# Altium schematic sheet Sch_Rele.SchDoc: Control de Domótica
size A4; Author: Francisco González González - Eugenia Ipar; CompanyName: Circuito de Relés; DocumentNumber: 7; SheetNumber: 7; SheetTotal: 12; Materia: Técnicas Digitales II; Placa: Conexión a Relés - 12V; Year: 2015; Prof1: Prof: Alarcón, Juan; Prof2: Ayud: Crivelli, Marcelo; Prof3: Ayud: Montalti, Pablo; PageSetup: Record=PageOptions|CenterHorizontal=True|CenterVertical=True|PrintScale=1.00|XCorrection=1.00|YCorrection=1.00|PrintKind=0|BorderSize=5000000|LeftOffset=0|BottomOffset=0|Orientation=2|PaperLength=1000|PaperWidth=1000|Scale=100|PaperSource=7|PrintQuality=-3|MediaType=1|DitherType=10|PrintScaleMode=1|PaperKind=A4|PaperIndex=9
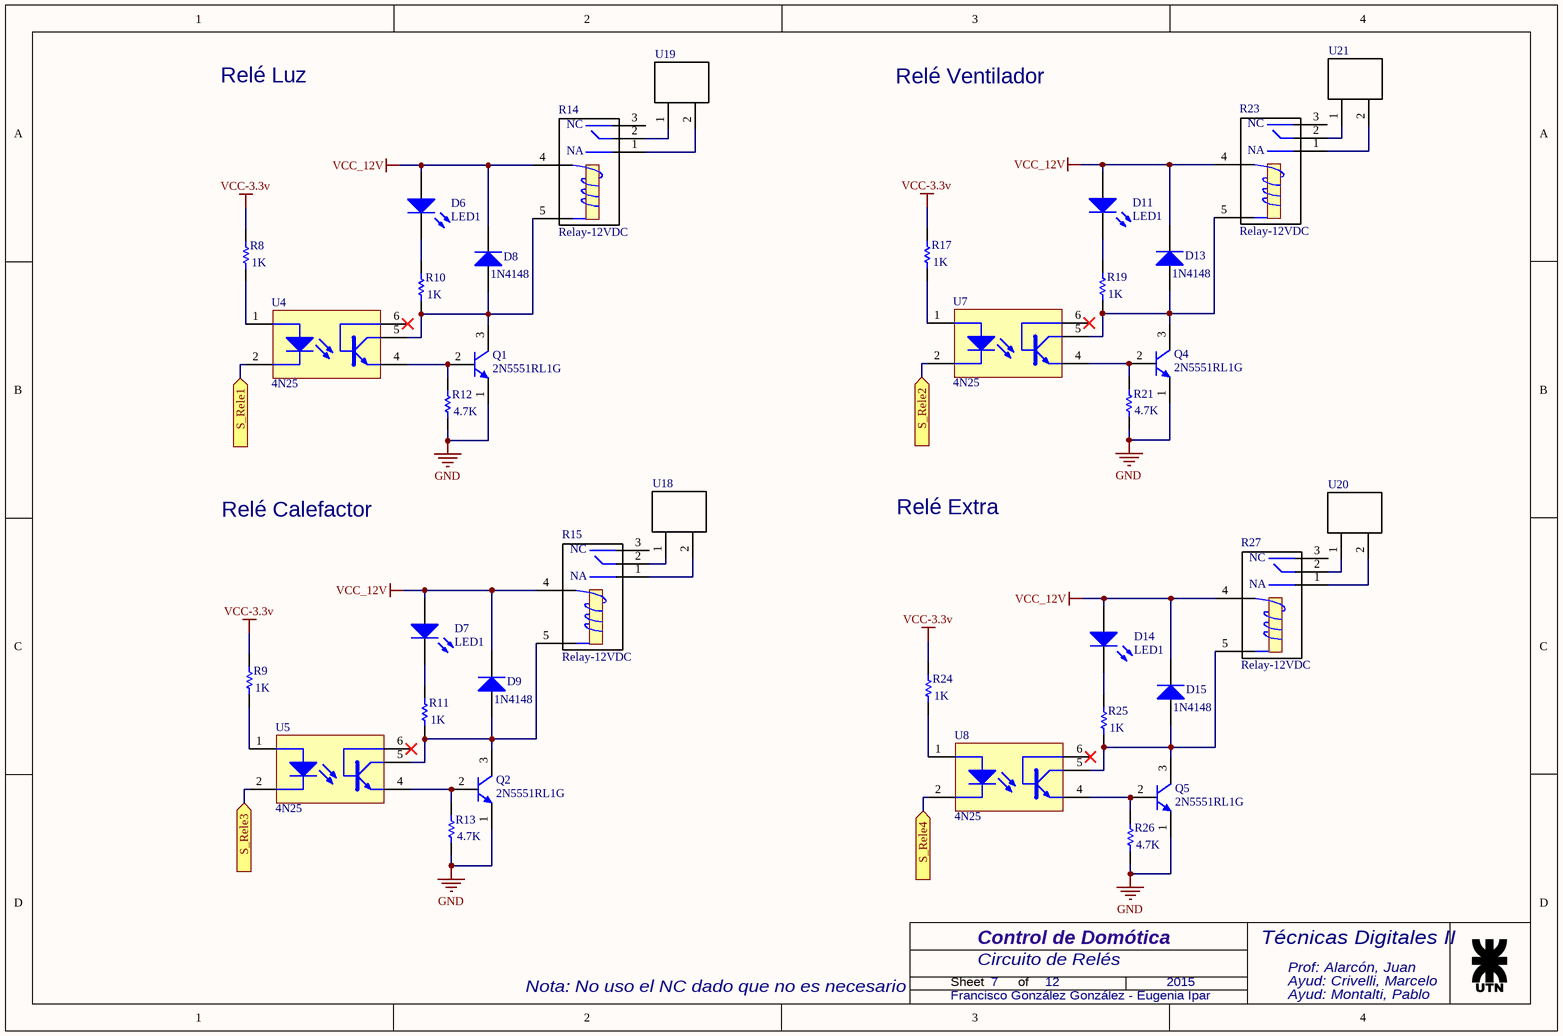
[diagram p0: Sch_Rele.SchDoc]

## Parts
D6  LED1  [Type 3mm]
D7  LED1  [Type 3mm]
D8  1N4148  [DO-35]
D9  1N4148  [DO-35]
D11  LED1  [Type 3mm]
D13  1N4148  [DO-35]
D14  LED1  [Type 3mm]
D15  1N4148  [DO-35]
Q1  2N5551RL1G  [ONSC-TO-92-3-29-11_AM_BL]
Q2  2N5551RL1G  [ONSC-TO-92-3-29-11_AM_BL]
Q4  2N5551RL1G  [ONSC-TO-92-3-29-11_AM_BL]
Q5  2N5551RL1G  [ONSC-TO-92-3-29-11_AM_BL]
R8  value 1K  [AXIAL-0.3]  (hidden comment: Res1)
R9  value 1K  [AXIAL-0.3]  (hidden comment: Res1)
R10  value 1K  [AXIAL-0.3]  (hidden comment: Res1)
R11  value 1K  [AXIAL-0.3]  (hidden comment: Res1)
R12  value 4.7K  [AXIAL-0.3]  (hidden comment: Res1)
R13  value 4.7K  [AXIAL-0.3]  (hidden comment: Res1)
R14  Relay-12VDC  [Rele]
R15  Relay-12VDC  [Rele]
R17  value 1K  [AXIAL-0.3]  (hidden comment: Res1)
R19  value 1K  [AXIAL-0.3]  (hidden comment: Res1)
R21  value 4.7K  [AXIAL-0.3]  (hidden comment: Res1)
R23  Relay-12VDC  [Rele]
R24  value 1K  [AXIAL-0.3]  (hidden comment: Res1)
R25  value 1K  [AXIAL-0.3]  (hidden comment: Res1)
R26  value 4.7K  [AXIAL-0.3]  (hidden comment: Res1)
R27  Relay-12VDC  [Rele]
U4  4N25  [DIP6]
U5  4N25  [DIP6]
U7  4N25  [DIP6]
U8  4N25  [DIP6]
U18  Bornera_2P  [Bornera]  (value not drawn)
U19  Bornera_2P  [Bornera]  (value not drawn)
U20  Bornera_2P  [Bornera]  (value not drawn)
U21  Bornera_2P  [Bornera]  (value not drawn)

## Ports
S_Rele1 (in), S_Rele2 (in), S_Rele3 (in), S_Rele4 (in)

## Nets
GND: Q1.1(E) Q2.1(E) Q4.1(E) Q5.1(E) R12.1 R13.1 R21.1 R26.1
VCC-3.3v: R8.2 R9.2 R17.2 R24.2
VCC_12V: D6.2(A) D7.2(A) D8.2(K) D9.2(K) D11.2(A) D13.2(K) D14.2(A) D15.2(K) R14.4 R15.4 R23.4 R27.4
S_Rele1: U4.2 ; port S_Rele1
S_Rele2: U7.2 ; port S_Rele2
S_Rele3: U5.2 ; port S_Rele3
S_Rele4: U8.2 ; port S_Rele4
NetD6_1: D6.1(K) R10.2
NetD7_1: D7.1(K) R11.2
NetD8_1: D8.1(A) Q1.3(C) R10.1 R14.5 U4.5
NetD9_1: D9.1(A) Q2.3(C) R11.1 R15.5 U5.5
NetD11_1: D11.1(K) R19.2
NetD13_1: D13.1(A) Q4.3(C) R19.1 R23.5 U7.5
NetD14_1: D14.1(K) R25.2
NetD15_1: D15.1(A) Q5.3(C) R25.1 R27.5 U8.5
NetQ1_2: Q1.2(B) R12.2 U4.4
NetQ2_2: Q2.2(B) R13.2 U5.4
NetQ4_2: Q4.2(B) R21.2 U7.4
NetQ5_2: Q5.2(B) R26.2 U8.4
NetR8_1: R8.1 U4.1
NetR9_1: R9.1 U5.1
NetR14_1: R14.1 U19.2
NetR14_2: R14.2 U19.1
NetR15_1: R15.1 U18.2
NetR15_2: R15.2 U18.1
NetR17_1: R17.1 U7.1
NetR23_1: R23.1 U21.2
NetR23_2: R23.2 U21.1
NetR24_1: R24.1 U8.1
NetR27_1: R27.1 U20.2
NetR27_2: R27.2 U20.1

Not connected (* = marked no-connect by the designer): R14 3; R15 3; R23 3; R27 3; U4 6*; U5 6*; U7 6*; U8 6*

## Notes on the sheet
- Relé Luz
- Relé Ventilador
- Relé Calefactor
- Relé Extra
- Nota: No uso el NC dado que no es necesario
- Sheet
- of
- (in symbol Component_1) NC; NA

## Library data of the parts
D6 D7 D11 D14 = CMP-1488-00002-1: THT LED round mono-color color lens, WL-TMRW, Super Red; PartNumber: 151031SS06000; Manufacturer: Wuerth Elektronik; ComponentLink2URL: http://katalog.we-online.de/pbs/datasheet/7448042001.pdfhttp://katalog.we-online.de/pbs/datasheet/7448042001.pdfhttp://katalog.we-online.de/pbs/datasheet/7448042001.pdfhttp://katalog.we-online.de/pbs/datasheet/151031SS06000.pdf; ComponentLink1URL: http://www.we-online.com; ComponentLink2Description: Datasheet; PackageReference: Type 3mm; Emitting color: Super Red; ComponentLink1Description: Manufacturer URL
D8 D9 D13 D15 = Diode 1N4148: High Conductance Fast Diode; Published: 8-Jun-2000; LatestRevisionDate: 17-Jul-2002; LatestRevisionNote: Re-released for DXP Platform.; DatasheetVersion: 1997; PackageReference: DO-35; Publisher: Altium Limited; PackageDescription: Diode, Axial; Body 3.8 x 1.9 mm (LxDia. max), Lead Dia. 0.53 mm (max); Code_JEDEC: DO-204-AH; ComponentLink1Description: Manufacturer Link; ComponentLink1URL: http://www.fairchildsemi.com/; ComponentLink2Description: Datasheet; ComponentLink2URL: http://www.fairchildsemi.com/ds/1N%2F1N4148.pdf
Q1 Q2 Q4 Q5 = CMP-1048-01479-1: Amplifier Transistor, NPN Silicon, 3-Pin TO-92, Pb-Free, Tape and Reel; Manufacturer: On Semiconductor; fT Min (MHz): 100; IC Continuous (A): 0.6; ComponentLink3Description: Package Specification; PackageDescription: 3-Pin Transistor Outline, Body 4.825 x 3.685 mm, Pitch 1.27 mm; ComponentLink1Description: Manufacturer URL; Mounting Technology: Through Hole; Packing: Tape and Reel; PartNumber: 2N5551RL1G; ComponentLink3URL: http://www.onsemi.com/pub_link/Collateral/MAC97-D.PDF; PackageReference: TO-92-3-29-11_AM_BL; ComponentLink2Description: Datasheet; PackageVersion: Rev. AM; DatasheetVersion: Rev. 5; ComponentLink1URL: http://www.onsemi.com/; RoHS: TRUE; ComponentLink2URL: http://www.onsemi.com/pub_link/Collateral/2N5550-D.PDF; Polarity: NPN
R8-R13 R17 R19 R21 R24-R26 = Res1: Resistor; Published: 8-Jun-2000; LatestRevisionDate: 17-Jul-2002; LatestRevisionNote: Re-released for DXP Platform.; PackageReference: AXIAL-0.3; Publisher: Altium Limited; PackageDescription: Axial Device, Thru-Hole; 2 Leads; 0.3 in Pin Spacing
R14 R15 R23 R27 = Component_1
U4 U5 U7 U8 = Opto-4N25: Optoacoplador